# EAGLE design EIB2RS232 (EAGLE 4.15)
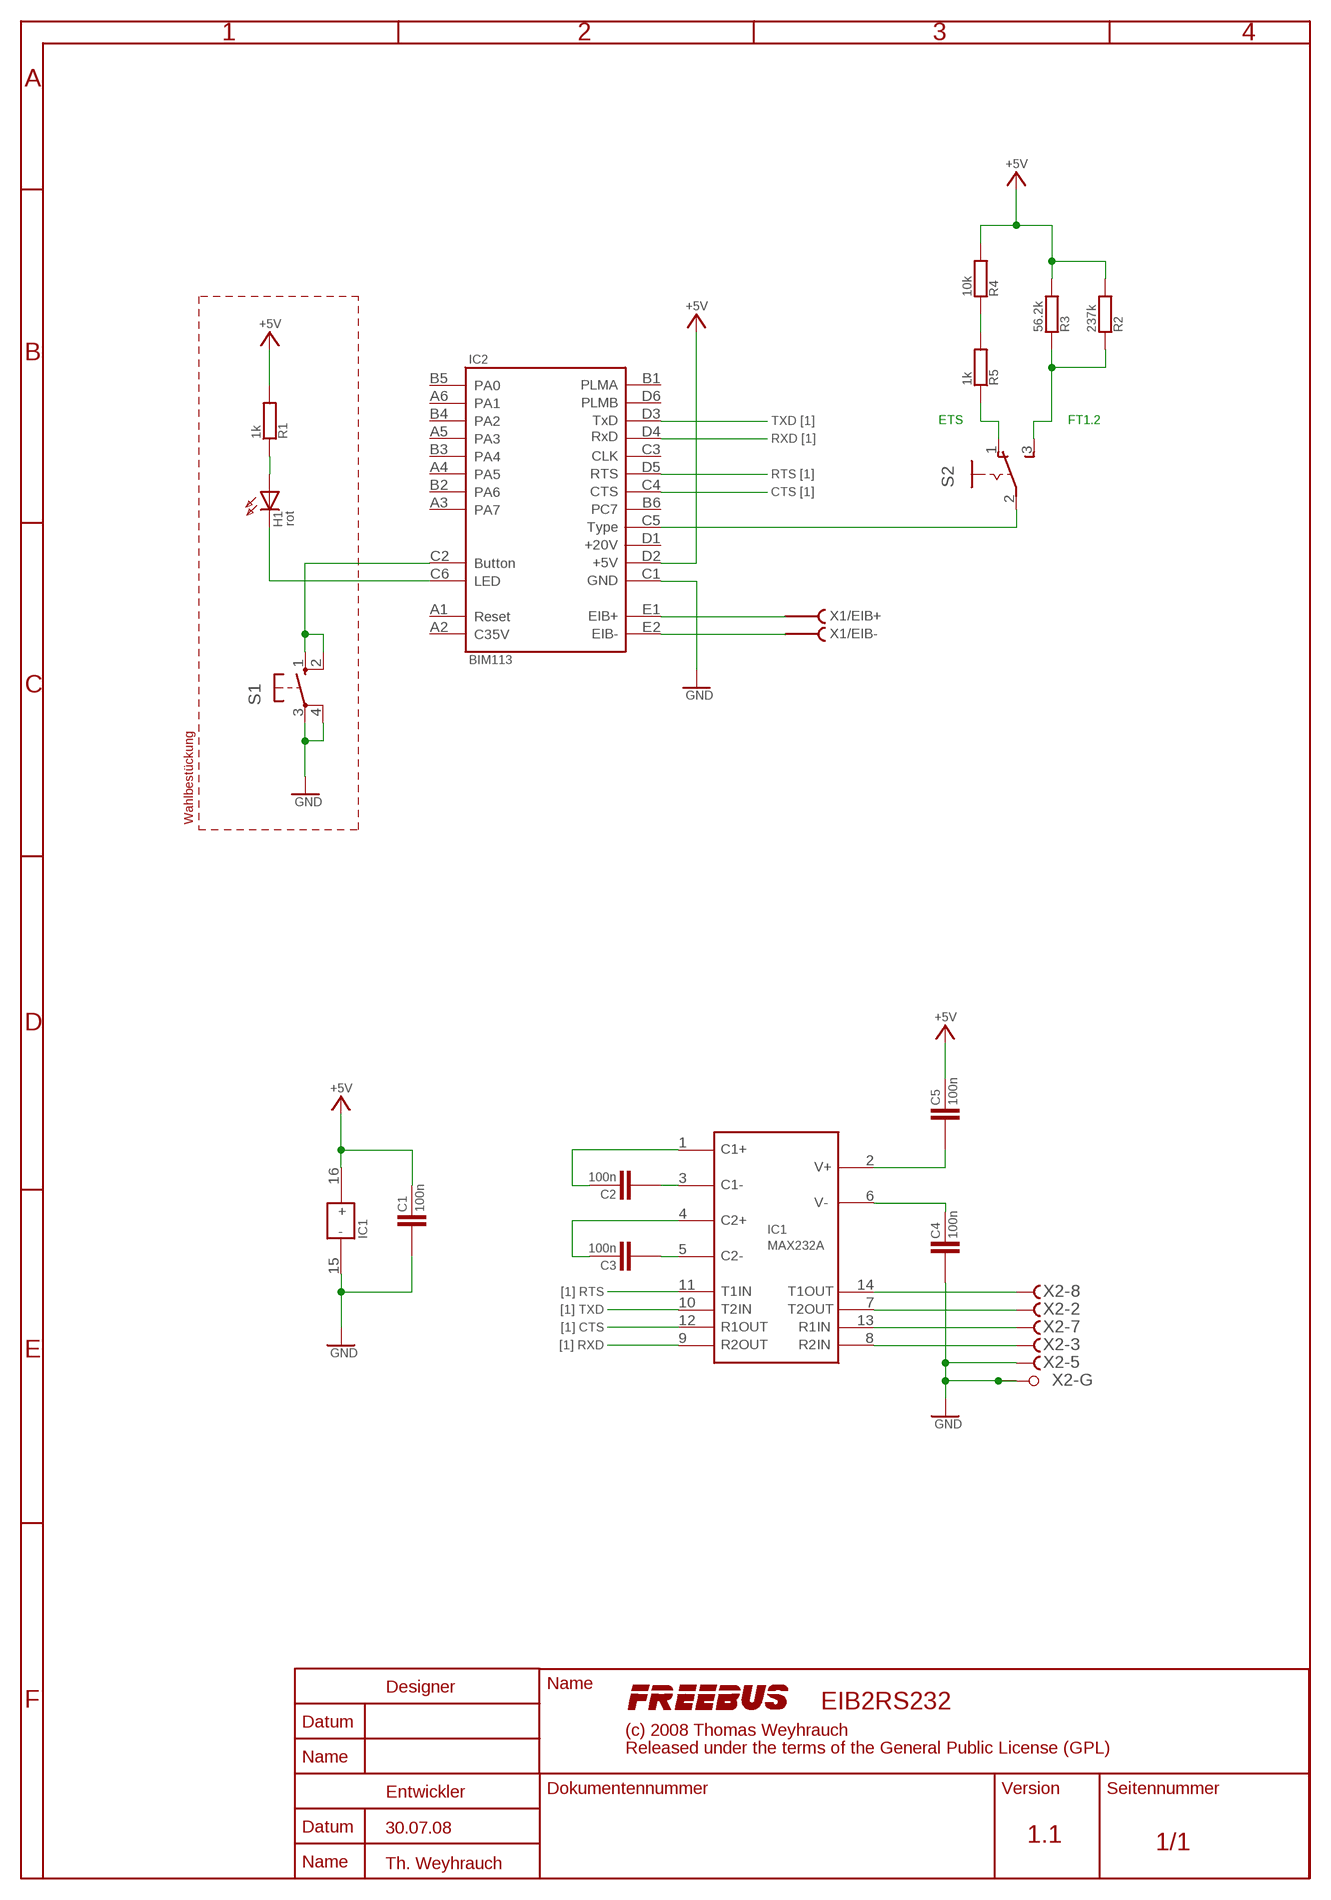
[diagram p0: schematic, sheet 1]

## Parts
C1  100n  C-0805  [0805]
C2  100n  C-0805  [0805]
C3  100n  C-0805  [0805]
C4  100n  C-0805  [0805]
C5  100n  C-0805  [0805]
H1  rot  LED_1.25X2  [LED_1.25X2.0]
IC1  MAX232A  [SO16]
IC2  BIM113  [BIM113]
R1  1k  R-0805  [0805]
R2  237k  R-0805  [0805]
R3  56.2k  R-0805  [0805]
R4  10k  R-0805  [0805]
R5  1k  R-0805  [0805]
S1  10-XX  [B3F-10XX]
S2  M251  [M251]
X1  EIB-BUSKLEMME  [EIB-BUSKLEMME]
X2  F09HPS  [F09HP]

## Nets
+5V [power]: C1.1 C5.1 IC1.16(P:+5V) IC2.D2(+5V) R1.2 R2.2 R3.2 R4.2
CTS: IC1.12(A:R1OUT) IC2.C4(CTS)
GND [power]: C1.2 C4.2 IC1.15(P:GND) IC2.C1(GND) S1.3(P) S1.4(P1) X2.5(-5:F) X2.G1(-G:G1) X2.G2(-G:G2)
N$1: C2.2 IC1.3(A:C1-)
N$2: C2.1 IC1.1(A:C1+)
N$3: C3.1 IC1.4(A:C2+)
N$4: C3.2 IC1.5(A:C2-)
N$5: C4.1 IC1.6(A:V-)
N$6: C5.2 IC1.2(A:V+)
N$7: H1.A R1.1
N$8: H1.K(C) IC2.C6(LED)
N$9: R5.1 S2.1(O)
N$10: R2.1 R3.1 S2.3(S)
N$11: IC2.C5(TYPE) S2.2(P)
N$12: IC1.14(A:T1OUT) X2.8(-8:F)
N$13: R4.1 R5.2
N$14: IC1.7(A:T2OUT) X2.2(-2:F)
N$15: IC2.C2(BUTTON) S1.1(S) S1.2(S1)
N$16: IC2.E1(EIB+) X1.+
N$17: IC2.E2(EIB-) X1.-
N$18: IC1.13(A:R1IN) X2.7(-7:F)
N$21: IC1.8(A:R2IN) X2.3(-3:F)
RTS: IC1.11(A:T1IN) IC2.D5(RTS)
RXD: IC1.9(A:R2OUT) IC2.D4(RXD)
TXD: IC1.10(A:T2IN) IC2.D3(TXD)
Unconnected: IC2.A1(RESET) IC2.A2(C35V) IC2.A3(PA7) IC2.A4(PA5) IC2.A5(PA3) IC2.A6(PA1) IC2.B1(PLMA) IC2.B2(PA6) IC2.B3(PA4) IC2.B4(PA2) IC2.B5(PA0) IC2.B6(PC7) IC2.C3(CLK) IC2.D1(+20V) IC2.D6(PLMB) X2.1(-1:F) X2.4(-4:F) X2.6(-6:F) X2.9(-9:F)

## Notes on the sheet
- ETS
- TXD [1] | FT1.2
- RXD [1]
- RTS [1]
- CTS [1]
- Wahlbestückung
- [1] RTS
- [1] TXD
- [1] CTS
- [1] RXD
- EIB2RS232
- (c) 2008 Thomas Weyhrauch
- Released under the terms of the General Public License (GPL)
- 30.07.08
- 1.1
- Th. Weyhrauch

## Library data of the parts
C1-C5 = weyhrauch:C
H1 = weyhrauch:LED_1.25X2
IC1 = weyhrauch:MAX232A: RS232 TRANSEIVER
IC2 = freebus:BIM113
R1-R5 = weyhrauch:R
S1 = switch-omron:10-XX: OMRON SWITCH
S2 = switch:M251: SLIDING SWITCH Mors, distributor Buerklin, 11G702
X1 = freebus:EIB-BUSKLEMME
X2 = con-subd:F09HPS: SUB-D

## Net classes
1 power: width 0.406 mm

## Board
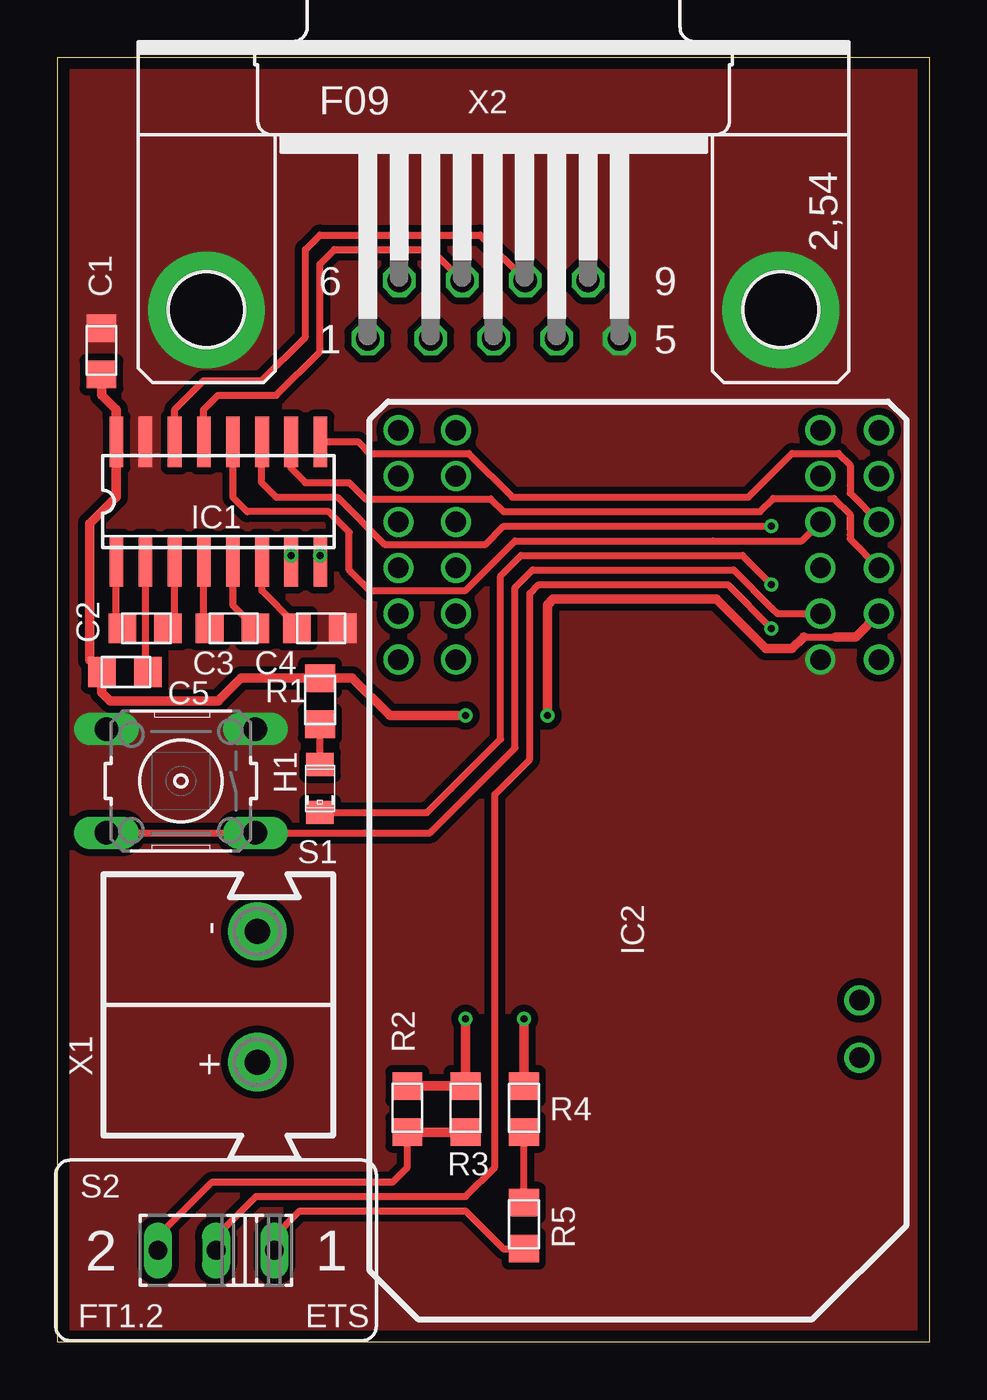
[diagram p1: board, top side]
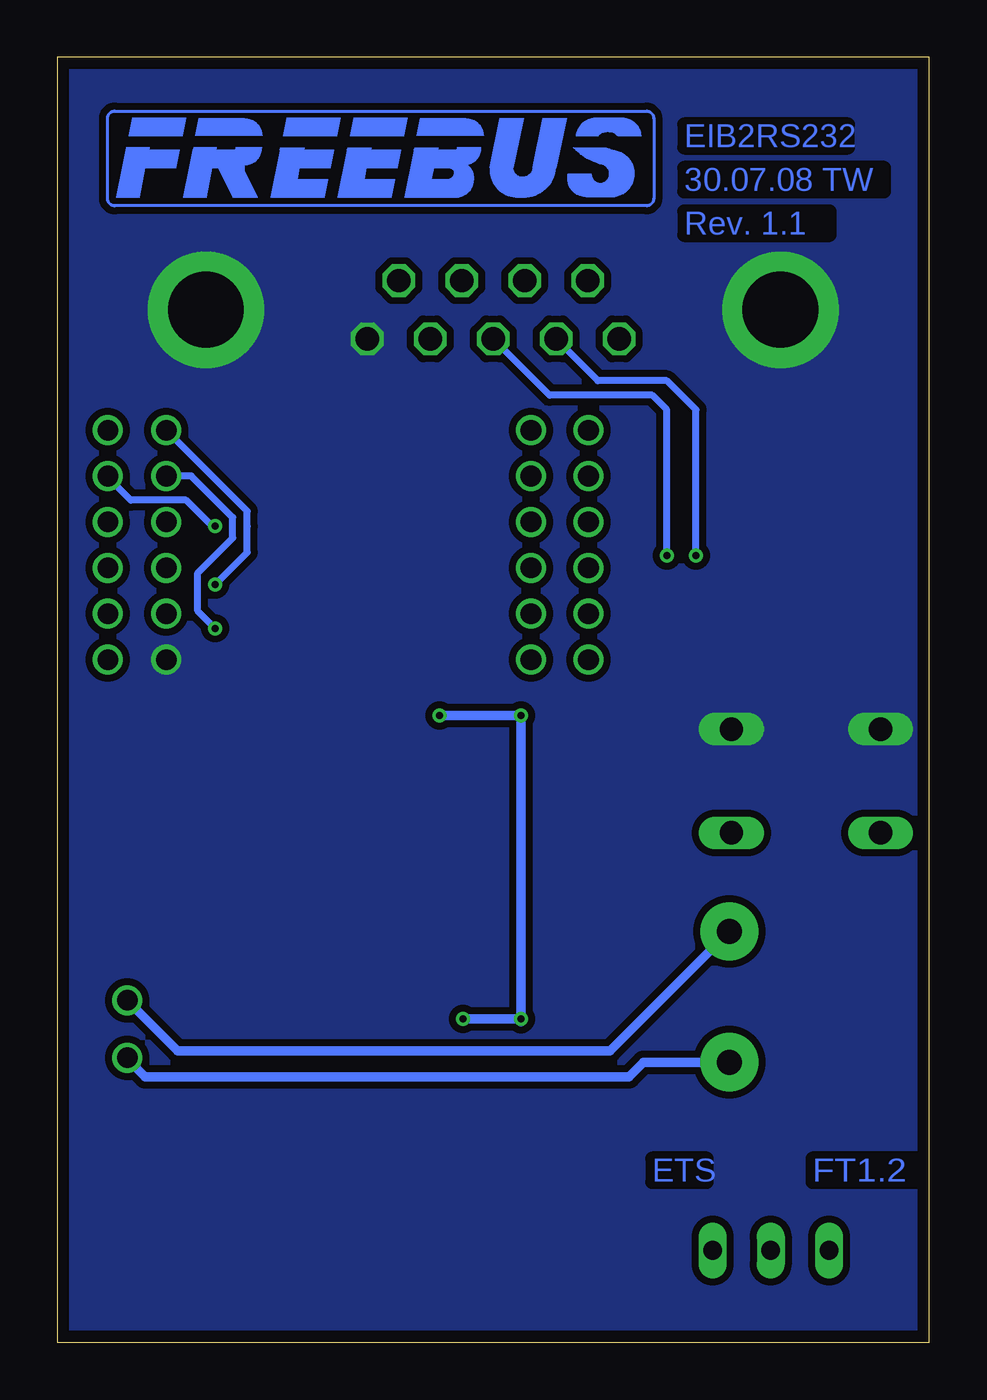
[diagram p2: board, bottom side, seen from below]

Size 38 x 56 mm. Coordinates in mm from the lower left corner, seen from the top.
Outline: 0,0 0,56 38,56 38,0 0,0
Copper layers (1*16): Top 0.035mm / dielectric 1.5mm / Bottom 0.035mm
Design rules "pcb-pool": minimum track width 6mil, minimum drill 12mil, track to track 6mil, track to pad 6mil, pad to pad 6mil, via to via 6mil, smd to smd 6mil, copper to edge 20mil, drill to drill 8mil, minimum pad ring 8mil, minimum via ring 6mil, stop-mask expansion 3mil, vias tented up to drill 0mil, thermal gap 8mil
Holes 0.3 mm at 65.9,27.68
Holes 0.81 mm at 65.9,22.6
Holes 0.9 mm at 65.9,17.52
Holes 1.02 mm at 65.9,12.44
Holes 1.1 mm at 65.9,7.36
Holes 3.3 mm at 65.9,2.28

### Footprints (pad centres in the part's own frame; a part is rotated, then mirrored left to right if it is on the bottom)
0805 = smd 1.3 x 1.2: 1 0.002,1; 2 0.002,-1
LED_1.25X2.0 = smd 1 x 1.2: A 1.05,0; K -1.05,0
SO16 = smd 0.6 x 2.2: 1 -4.445,-2.6; 2 -3.175,-2.6; 3 -1.905,-2.6; 4 -0.635,-2.6; 5 0.635,-2.6; 6 1.905,-2.6; 7 3.175,-2.6; 8 4.445,-2.6; 9 4.445,2.6; 10 3.175,2.6; 11 1.905,2.6; 12 0.635,2.6; 13 -0.635,2.6; 14 -1.905,2.6; 15 -3.175,2.6; 16 -4.445,2.6
BIM113 = drill 0.9 round: A1 28.75,22.15; A2 30.75,22.15; A3 32.75,22.15; A4 34.75,22.15; A5 36.75,22.15; A6 38.75,22.15; B1 28.75,19.65; B2 30.75,19.65; B3 32.75,19.65; B4 34.75,19.65; B5 36.75,19.65; B6 38.75,19.65; C1 28.75,3.75; C2 30.75,3.75; C3 32.75,3.75; C4 34.75,3.75; C5 36.75,3.75; C6 38.75,3.75; D1 28.75,1.2; D2 30.75,1.2; D3 32.75,1.2; D4 34.75,1.2; D5 36.75,1.2; D6 38.75,1.2; E1 11.4,2.05; E2 13.9,2.05
B3F-10XX = drill 1.016 long: 1 -3.251,2.261; 2 3.251,2.261; 3 -3.251,-2.261; 4 3.251,-2.261
M251 = drill 0.813 long: 1 -2.54,0; 2 0,0; 3 2.54,0
EIB-BUSKLEMME = drill 1.1 pad 2.54 round: + 8.2,6.7; - 2.5,6.7
F09HP = drill 1.016 octagon: 1 -5.486,-1.27; 2 -2.743,-1.27; 3 0,-1.27; 4 2.743,-1.27; 5 5.486,-1.27; 6 -4.115,1.27; 7 -1.372,1.27; 8 1.372,1.27; 9 4.115,1.27 | drill 3.302 pad 5.08 round: G1 -12.522,0; G2 12.522,0

### Placement (x,y rotation side)
C1  1.91,43.18 180 top
C2  3.81,31.11 90 top
C3  7.62,31.11 90 top
C4  11.43,31.11 90 top
C5  2.92,29.21 90 top
H1  11.43,24.13 90 top
IC1  7,36.63 0 top
IC2  37,1 90 top
R1  11.43,27.94 180 top
R2  15.24,10.16 180 top
R3  17.78,10.16 180 top
R4  20.32,10.16 180 top
R5  20.32,5.08 180 top
S1  5.37,24.46 180 top
S2  6.9,4 180 top
U$100  [FREEBUS-LOGO]  35.81,49.53 0 bottom
X1  2,20.4 270 top
X2  19,45 0 top

### Tracks (layer width: path | path; a pad name or v marks a point on that pad's centre or on a via)
+5V  (via drill 0.3)
  Top 0.305: 32.51,30.73 33.91,30.73
  Top 0.406: 17.78,11.18 R3.2 17.78,11.18 | R2.2 15.25,11.18 17.78,11.18 | C1.1 1.91,41.27 2.54,40.64 2.54,39.25 IC1.16 2.56,36.84 1.4,35.69 1.4,29.74 C5.1 1.91,29.21 1.91,28.32 2.29,27.94 6.99,27.94 8,28.96 11.43,28.96 R1.2 11.44,28.96 12.83,28.96 14.48,27.3 v17.78,27.3 | R4.2 v20.32,14.1 | 17.78,11.18 v17.78,14.1 | 32.51,30.73 32,30.23 30.86,30.23 28.7,32.38 21.59,32.38 21.34,32.13 v21.34,27.3 | IC2.D2 34.78,30.73 33.91,30.73
  Bottom 0.406: v17.78,14.1 v20.32,14.1 | v17.78,14.1 17.78,13.97 | v17.78,14.1 v17.78,27.3 v21.34,27.3
CTS
  Top 0.305: IC1.12 7.63,36.81 8.26,36.2 11.81,36.2 12.7,35.31 12.7,33.66 13.59,32.77 17.78,32.77 19.94,34.92 28.57,34.92 32.42,34.92 IC2.C4
GND
  pour Bottom (isolate 0.305, no thermals): 0,0 38.1,0 38.1,56.52 0,56.52
  pour Top (isolate 0.305, no thermals): 0,0 38.1,0 38.1,56.52 0,56.52
N$1
  Top 0.305: C2.2 4.82,31.12 4.83,31.11 5.09,31.38 IC1.3
N$2
  Top 0.305: C2.1 2.8,31.12 2.79,31.11 2.56,31.35 IC1.1
N$3
  Top 0.305: C3.1 6.61,31.12 6.6,31.11 6.37,31.35 IC1.4
N$4
  Top 0.305: 8.63,31.12 8.64,31.11 | C3.2 8.63,31.12 | IC1.5 7.63,32.12 8.63,31.12
N$5
  Top 0.305: IC1.6 8.9,32.75 10.29,31.37 10.41,31.11 C4.1
N$6
  Top 0.305: C5.2 3.55,29.21 3.56,29.21 3.83,29.48 IC1.2
N$7
  Top 0.305: R1.1 H1.A
N$8  (via drill 0.3)
  Top 0.305: 17.14,24.13 16.51,23.5 | 17.14,24.13 19.3,26.29 19.3,33.4 20.19,34.29 29.84,34.29 v31.11,33.02 | H1.K 16.09,23.08 17.14,24.13
  Bottom 0.305: v31.11,33.02 29.72,34.42 29.72,35.56 29.72,36.22 IC2.C6
N$9
  Top 0.305: S2.1 9.4,4.04 9.4,4.57 10.54,5.71 17.78,5.71 19.43,4.06 20.32,4.06 R5.1
N$10
  Top 0.305: 17.78,9.14 R3.1 | 15.25,9.14 R2.1 15.24,7.62 14.61,6.99 6.73,6.99 4.36,4.61 S2.3
  Top 0.406: 15.25,9.14 17.78,9.14
N$11  (via drill 0.3)
  Top 0.305: v31.11,31.11 29.21,33.02 20.95,33.02 20.57,32.64 20.57,25.4 19.05,23.88 19.05,7.62 17.78,6.35 8.64,6.35 6.9,4.61 S2.2
  Bottom 0.305: IC2.C5 32.16,37.75 30.35,35.94 30.35,35.05 31.88,33.53 31.88,31.88 v31.11,31.11
N$12
  Top 0.305: IC1.14 5.09,40.66 6.35,41.91 8.89,41.91 10.79,43.81 10.79,47.62 11.43,48.26 18.41,48.26 20.37,46.3 X2.8
N$13
  Top 0.305: R4.1 R5.2
N$14  (via drill 0.3)
  Top 0.305: IC1.7 10.16,34.05 v10.16,34.29
  Bottom 0.305: v10.16,34.29 10.16,40.64 11.43,41.91 14.44,41.91 X2.2
N$15
  Top 0.305: 17.78,23.75 16.26,22.23 | 17.78,23.75 19.94,25.91 19.94,32.89 20.7,33.66 29.46,33.66 31.11,32 31.37,31.75 IC2.C2 | S1.1 8.64,22.23 | S1.1 16.23,22.2 17.78,23.75 | S1.2 S1.1
N$16
  Bottom 0.406: IC2.E1 34.95,12.34 34.16,11.56 13.08,11.56 12.45,12.19 X1.+
N$17
  Bottom 0.406: 32.75,12.7 IC2.E2 | 32.75,12.7 32.77,12.7 | X1.- 13.9,12.7 32.75,12.7
N$18
  Top 0.305: IC1.13 6.37,40.62 6.35,40.64 6.99,41.27 9.53,41.27 11.43,43.18 11.43,46.99 12.06,47.62 16.27,47.62 X2.7
N$21  (via drill 0.3)
  Top 0.305: IC1.8 11.43,34.05 v11.43,34.29
  Bottom 0.305: v11.43,34.29 11.43,40.64 12.06,41.27 16.55,41.27 X2.3
RTS  (via drill 0.3)
  Top 0.305: IC1.11 8.89,37.47 9.53,36.83 12.19,36.83 14.25,34.77 18.64,34.77 19.43,35.56 v31.11,35.56
  Bottom 0.305: 35.56,37.47 34.8,36.7 32.38,36.7 31.24,35.56 v31.11,35.56 | 35.56,37.47 35.81,37.72 35.8,37.73 35.56,37.49 35.56,37.47 | 35.56,37.47 35.56,37.51 IC2.D5
RXD
  Top 0.305: IC1.9 11.45,39.24 13.08,39.24 13.59,38.73 17.91,38.73 19.81,36.83 30.1,36.83 32,38.73 34.04,38.73 34.54,38.23 34.54,37.34 34.54,37.01 IC2.D4
TXD
  Top 0.305: IC1.10 10.16,39.22 10.16,38.1 10.79,37.47 12.7,37.47 13.41,36.75 18.87,36.75 19.43,36.2 30.61,36.2 31.19,36.78 33.83,36.78 34.54,36.07 34.54,35.43 | 34.54,35.43 34.54,35.18 | IC2.D3 34.54,35.01 34.54,35.43 | 34.54,35.43 34.54,35.94

### Text on the board
Bottom: EIB2RS232 | 30.07.08 TW | Rev. 1.1 | FT1.2 | ETS
tPlace: FT1.2 | ETS
Drills: Bohrplan | SYM | SIZE | TOL. | CNT | PLATE | 0.3 mm | +/-0.1mm | 9 | Ja | 0.8 mm | +/-0.1mm | 3 | Ja | 0.9 mm | +/-0.1mm | 26 | Ja | 1.0 mm | +/-0.1mm | 13 | Ja | 1.1 mm | +/-0.1mm | 2 | Ja | 3.3 mm | +/-0.1mm | 2 | Ja
licence: (c) 2008 Thomas Weyhrauch | Released under the terms of the General Public License (GPL)